# EAGLE design openplayer (EAGLE 4.16)
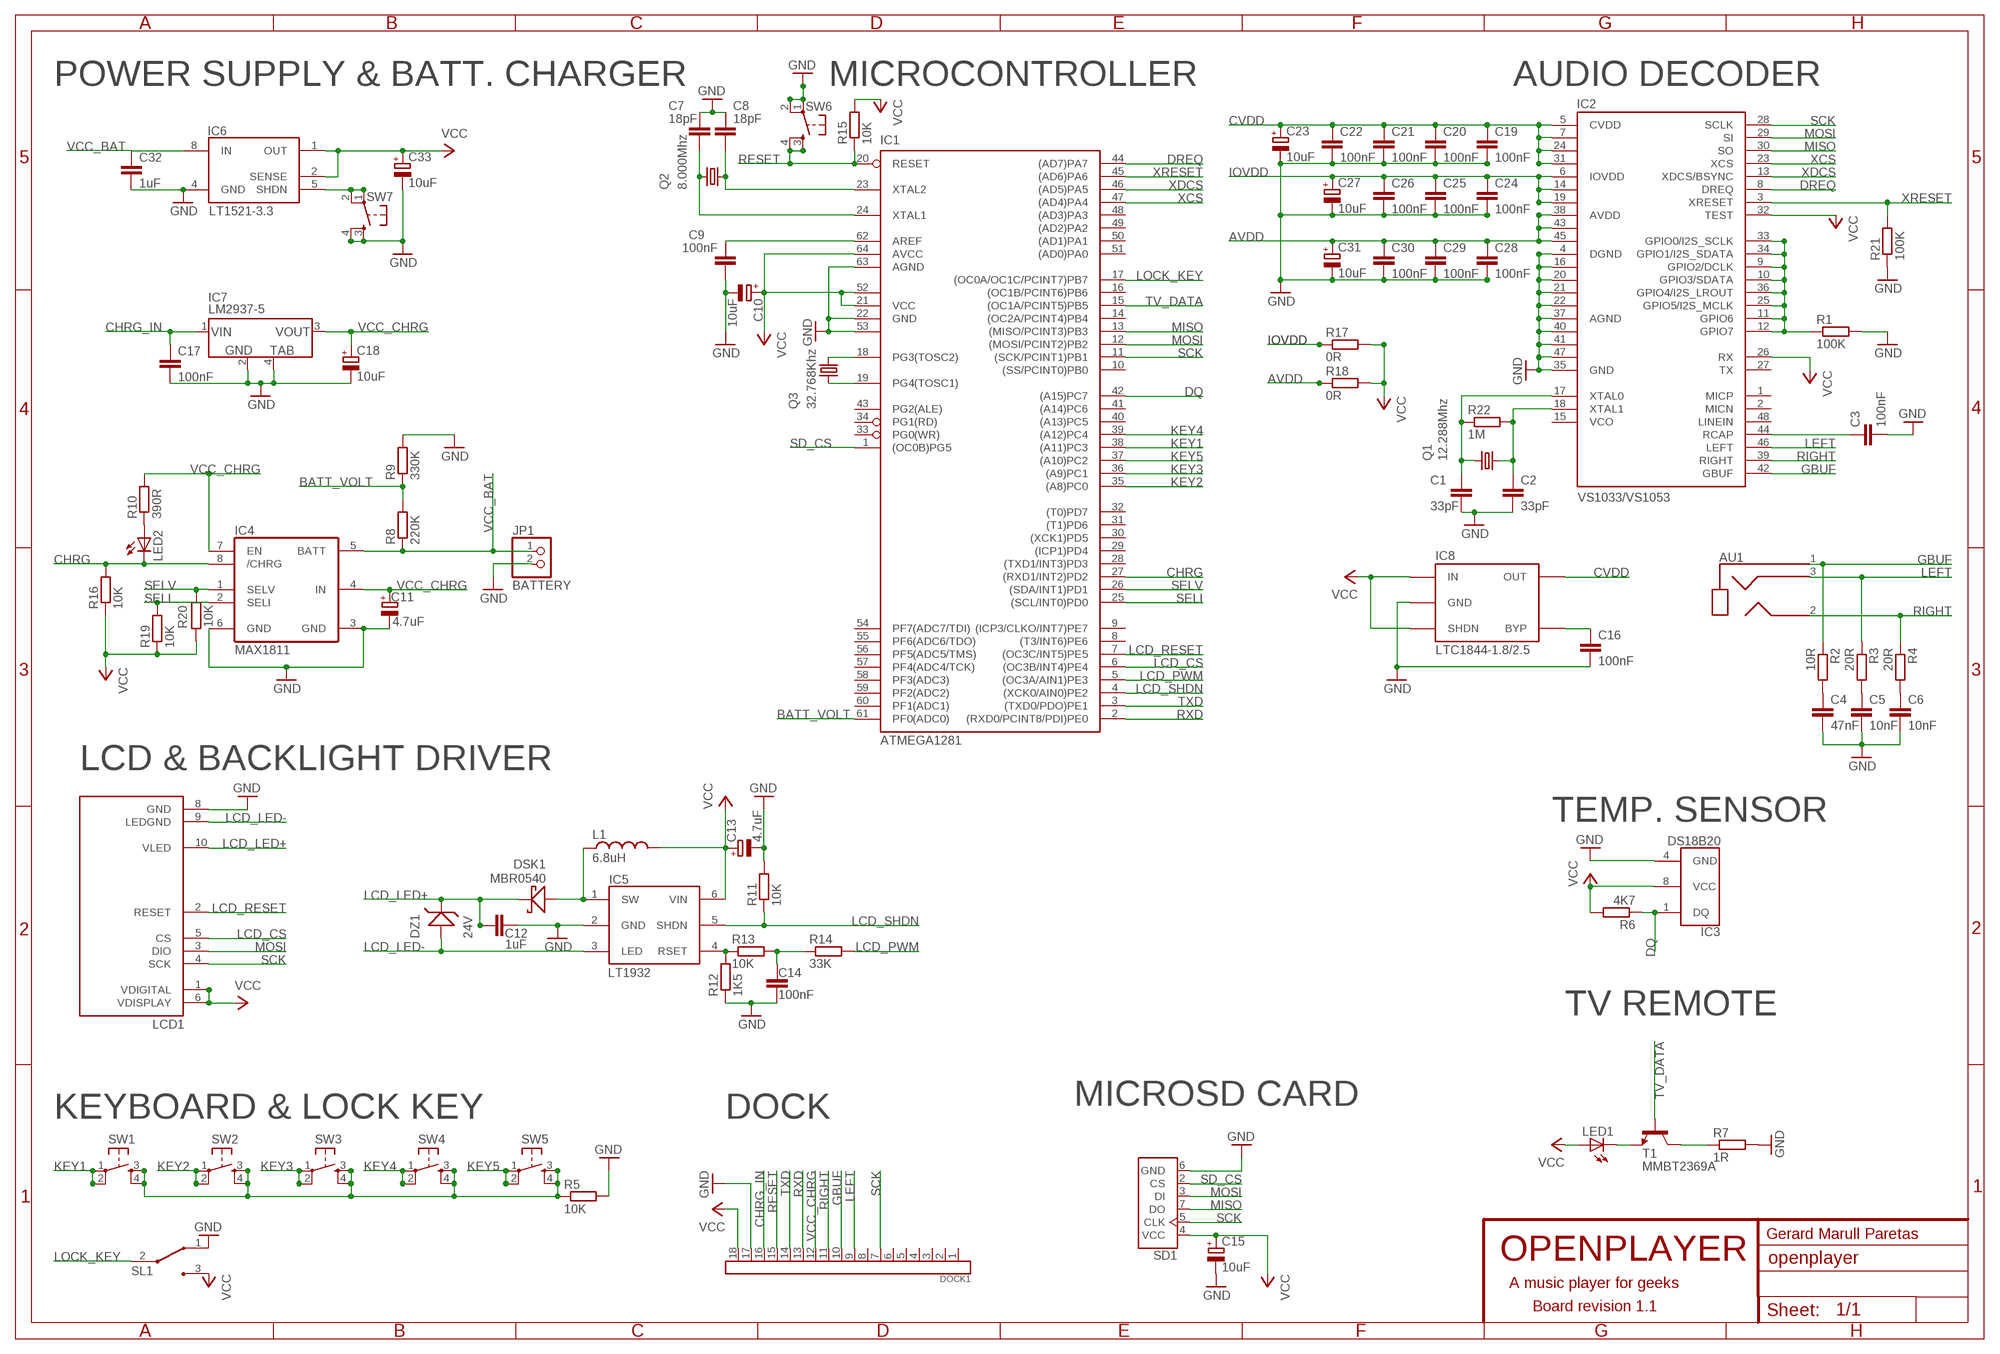
[diagram p0: schematic, sheet 1]

## Parts
AU1  AUDIOJACK_3.5MM  [AUDIOJACK3.5MM]
C1  33pF  C-EUC0805  [C0805]
C2  33pF  C-EUC0805  [C0805]
C3  100nF  C-EUC0805  [C0805]
C4  47nF  C-EUC0805  [C0805]
C5  10nF  C-EUC0805  [C0805]
C6  10nF  C-EUC0805  [C0805]
C7  18pF  C-EUC0805  [C0805]
C8  18pF  C-EUC0805  [C0805]
C9  100nF  C-EUC0805  [C0805]
C10  10uF  CPOL-EUR/2012-12R  [R/2012-12R]
C11  4.7uF  CPOL-EUA/3216-18R  [A/3216-18R]
C12  1uF  C-EUC0805  [C0805]
C13  4.7uF  CPOL-EUR/2012-12R  [R/2012-12R]
C14  100nF  C-EUC0805  [C0805]
C15  10uF  CPOL-EUR/2012-12R  [R/2012-12R]
C16  100nF  C-EUC0805  [C0805]
C17  100nF  C-EUC0805  [C0805]
C18  10uF  CPOL-EUA/3216-18W  [A/3216-18W]
C19  100nF  C-EUC0805  [C0805]
C20  100nF  C-EUC0805  [C0805]
C21  100nF  C-EUC0805  [C0805]
C22  100nF  C-EUC0805  [C0805]
C23  10uF  CPOL-EUR/2012-12R  [R/2012-12R]
C24  100nF  C-EUC0805  [C0805]
C25  100nF  C-EUC0805  [C0805]
C26  100nF  C-EUC0805  [C0805]
C27  10uF  CPOL-EUR/2012-12R  [R/2012-12R]
C28  100nF  C-EUC0805  [C0805]
C29  100nF  C-EUC0805  [C0805]
C30  100nF  C-EUC0805  [C0805]
C31  10uF  CPOL-EUR/2012-12R  [R/2012-12R]
C32  1uF  C-EUC0805  [C0805]
C33  10uF  CPOL-EUA/3216-18W  [A/3216-18W]
DOCK1  HS-ST60_18POS  [HS_ST60-18POS]
DSK1  MBR0540  SCHOTTKY-DIODE-MBR0540  [SOD-123]
DZ1  24V  ZENER_DIODE  [SOT23]
IC1  MEGA1281-A  [TQFP64]
IC2  VS1033/VS1053  VS1033  [LQFP48]
IC3  DS18B20USOP8  [USOP8]
IC4  MAX1811  [SO08]
IC5  LT1932  [S6]
IC6  LT1521-3.3  LT1521-3.3-MSOP  [USOP8]
IC7  LM2937-5  LM2937  [SOT223]
IC8  LTC1844-1.8/2.5  LTC1844  [SOT23-5]
JP1  BATTERY  PINHD-1X2  [1X02]
L1  6.8uH  INDUCTORS1008  [S1008]
LCD1  NOKIA6100_LCD  [NOKIA6100_LCD]
LED1  LED5MM  [LED5MM]
LED2  LEDCHIPLED_0603  [CHIPLED_0603]
Q1  12.288Mhz  CRYSTAL5.0X3.2MM  [CRYST5.0X3.2MM]
Q2  8.000Mhz  CRYSTAL6.0X3.6MM  [CRYST6.0X3.6MM]
Q3  32.768Khz  CRYSTAL3.2X1.5MM  [CRYST3.2X1.5MM]
R1  100K  R-EU_R0603  [R0603]
R2  10R  R-EU_R0603  [R0603]
R3  20R  R-EU_R0603  [R0603]
R4  20R  R-EU_R0603  [R0603]
R5  10K  R-EU_R0603  [R0603]
R6  4K7  R-EU_R0603  [R0603]
R7  1R  R-EU_R0603  [R0603]
R8  220K  R-EU_R0603  [R0603]
R9  330K  R-EU_R0603  [R0603]
R10  390R  R-EU_R0603  [R0603]
R11  10K  R-EU_R0603  [R0603]
R12  1K5  R-EU_R0603  [R0603]
R13  10K  R-EU_R0603  [R0603]
R14  33K  R-EU_R0603  [R0603]
R15  10K  R-EU_R0603  [R0603]
R16  10K  R-EU_R0603  [R0603]
R17  0R  R-EU_R0805  [R0805]
R18  0R  R-EU_R0805  [R0805]
R19  10K  R-EU_R0603  [R0603]
R20  10K  R-EU_R0603  [R0603]
R21  100K  R-EU_R0603  [R0603]
R22  1M  R-EU_R0603  [R0603]
SD1  SF-MICROSD  [MICROSD]
SL1  E-SWITCH_EG1270  [E-SWITCH_EG1270]
SW1  B3F-SWITCH  [B3FS-SWITCH]
SW2  B3F-SWITCH  [B3FS-SWITCH]
SW3  B3F-SWITCH  [B3FS-SWITCH]
SW4  B3F-SWITCH  [B3FS-SWITCH]
SW5  B3F-SWITCH  [B3FS-SWITCH]
SW6  ITT_SWITCH_SMALL  [ITT_SMALL_SWITCH]
SW7  ITT_SWITCH_SMALL  [ITT_SMALL_SWITCH]
T1  MMBT2369A  [SOT23]

## Nets
AVDD: C28.1 C29.1 C30.1 C31.+ IC2.38(AVDD) IC2.43(AVDD1) IC2.45(AVDD2) R18.1
BATT_VOLT: IC1.61(PF0(ADC0)) R8.2 R9.1
CHRG: IC1.27((RXD1/INT2)PD2) IC4.8(/CHRG) LED2.C R16.2
CHRG_IN: C17.1 DOCK1.16 IC7.1(VIN)
CVDD: C19.1 C20.1 C21.1 C22.1 C23.+ IC2.5(CVDD) IC2.7(CVDD1) IC2.24(CVDD2) IC2.31(CVDD3) IC8.5(OUT)
DQ: IC1.42((A15)PC7) IC3.1(DQ) R6.1
DREQ: IC1.44((AD7)PA7) IC2.8(DREQ)
GBUF: AU1.1 DOCK1.10 IC2.42(GBUF) R2.1
GND: C1.2 C2.2 C3.2 C4.2 C5.2 C6.2 C7.1 C8.1 C9.1 C10.- C11.- C12.2 C13.- C14.2 C15.- C16.2 C17.2 C18.- C19.2 C20.2 C21.2 C22.2 C23.- C24.2 C25.2 C26.2 C27.- C28.2 C29.2 C30.2 C31.- C32.2 C33.- DOCK1.17 IC1.22(GND) IC1.53(GND1) IC1.63(AGND) IC2.4(DGND) IC2.16(DGND1) IC2.20(DGND2) IC2.21(DGND3) IC2.22(DGND4) IC2.35(GND) IC2.37(AGND) IC2.40(AGND1) IC2.41(AGND2) IC2.47(AGND3) IC3.4(GND) IC4.3(GND) IC4.6(GND) IC5.2(GND) IC6.4(GND) IC7.2(GND) IC7.4 IC8.2(GND) JP1.2 LCD1.8(GND) R1.2 R5.2 R7.2 R9.2 R11.2 R12.1 R21.1 SD1.6(GND) SL1.1 SW6.1(P) SW6.2(P1) SW7.3(S) SW7.4(S1)
IOVDD: C24.1 C25.1 C26.1 C27.+ IC2.6(IOVDD) IC2.14(IOVDD1) IC2.19(IOVDD2) R17.1
KEY1: IC1.38((A11)PC3) SW1.1(P) SW1.2(P1)
KEY2: IC1.35((A8)PC0) SW2.1(P) SW2.2(P1)
KEY3: IC1.36((A9)PC1) SW3.1(P) SW3.2(P1)
KEY4: IC1.39((A12)PC4) SW4.1(P) SW4.2(P1)
KEY5: IC1.37((A10)PC2) SW5.1(P) SW5.2(P1)
LCD_CS: IC1.6((OC3B/INT4)PE4) LCD1.5(CS)
LCD_LED+: C12.1 DSK1.1 DZ1.3(AN) LCD1.10(VLED)
LCD_LED-: DZ1.1(CA) IC5.3(LED) LCD1.9(LEDGND)
LCD_PWM: IC1.5((OC3A/AIN1)PE3) R14.2
LCD_RESET: IC1.7((OC3C/INT5)PE5) LCD1.2(RESET)
LCD_SHDN: IC1.4((XCK0/AIN0)PE2) IC5.5(SHDN) R11.1
LEFT: AU1.3 DOCK1.9 IC2.46(LEFT) R3.1
LOCK_KEY: IC1.17((OC0A/OC1C/PCINT7)PB7) SL1.2
MISO: IC1.13((MISO/PCINT3)PB3) IC2.30(SO) SD1.7(DO)
MOSI: IC1.12((MOSI/PCINT2)PB2) IC2.29(SI) LCD1.3(DIO) SD1.3(DI)
N$1: C1.1 IC2.17(XTAL0) Q1.1 R22.1
N$2: C2.1 IC2.18(XTAL1) Q1.3 R22.2
N$3: C4.1 R2.2
N$4: C5.1 R3.2
N$5: C6.1 R4.2
N$6: C8.2 IC1.23(XTAL2) Q2.3
N$7: C7.2 IC1.24(XTAL1) Q2.1
N$8: C9.2 IC1.62(AREF)
N$9: IC2.9(GPIO2/DCLK) IC2.10(GPIO3/SDATA) IC2.11(GPIO6) IC2.12(GPIO7) IC2.25(GPIO5/I2S_MCLK) IC2.33(GPIO0/I2S_SCLK) IC2.34(GPIO1/I2S_SDATA) IC2.36(GPIO4/I2S_LROUT) R1.1
N$10: IC1.18(PG3(TOSC2)) Q3.2
N$11: IC1.19(PG4(TOSC1)) Q3.1
N$12: C3.1 IC2.44(RCAP)
N$13: R5.1 SW1.3(S) SW1.4(S1) SW2.3(S) SW2.4(S1) SW3.3(S) SW3.4(S1) SW4.3(S) SW4.4(S1) SW5.3(S) SW5.4(S1)
N$14: LED1.K(C) T1.3(E)
N$15: R7.1 T1.2(C)
N$18: LED2.A R10.1
N$19: DSK1.2 IC5.1(SW) L1.P$1
N$20: C16.1 IC8.4(BYP)
N$21: IC5.4(RSET) R12.2 R13.1
N$23: IC6.5(SHDN) SW7.1(P) SW7.2(P1)
N$24: C14.1 R13.2 R14.1
RESET: DOCK1.15 IC1.20(RESET) R15.1 SW6.3(S) SW6.4(S1)
RIGHT: AU1.2 DOCK1.11 IC2.39(RIGHT) R4.1
RXD: DOCK1.13 IC1.2((RXD0/PCINT8/PDI)PE0)
SCK: DOCK1.7 IC1.11((SCK/PCINT1)PB1) IC2.28(SCLK) LCD1.4(SCK) SD1.5(CLK)
SD_CS: IC1.1((OC0B)PG5) SD1.2(CS)
SELI: IC1.25((SCL/INT0)PD0) IC4.2(SELI) R19.2
SELV: IC1.26((SDA/INT1)PD1) IC4.1(SELV) R20.2
TV_DATA: IC1.15((OC1A/PCINT5)PB5) T1.1(B)
TXD: DOCK1.14 IC1.3((TXD0/PDO)PE1)
VCC: C10.+ C13.+ C15.+ C33.+ DOCK1.18 IC1.21(VCC) IC1.52(VCC1) IC1.64(AVCC) IC2.26(RX) IC2.32(TEST) IC3.8(VCC) IC5.6(VIN) IC6.1(OUT) IC6.2(SENSE) IC8.1(IN) IC8.3(SHDN) L1.P$2 LCD1.1(VDIGITAL) LCD1.6(VDISPLAY) LED1.A R6.2 R15.2 R16.1 R17.2 R18.2 R19.1 R20.1 SD1.4(VCC) SL1.3
VCC_BAT: C32.1 IC4.5(BATT) IC6.8(IN) JP1.1 R8.1
VCC_CHRG: C11.+ C18.+ DOCK1.12 IC4.4(IN) IC4.7(EN) IC7.3(VOUT) R10.2
XCS: IC1.47((AD4)PA4) IC2.23(XCS)
XDCS: IC1.46((AD5)PA5) IC2.13(XDCS/BSYNC)
XRESET: IC1.45((AD6)PA6) IC2.3(XRESET) R21.2
Unconnected: DOCK1.1 DOCK1.2 DOCK1.3 DOCK1.4 DOCK1.5 DOCK1.6 DOCK1.8 IC1.8((T3/INT6)PE6) IC1.9((ICP3/CLKO/INT7)PE7) IC1.10((SS/PCINT0)PB0) IC1.14((OC2A/PCINT4)PB4) IC1.16((OC1B/PCINT6)PB6) IC1.28((TXD1/INT3)PD3) IC1.29((ICP1)PD4) IC1.30((XCK1)PD5) IC1.31((T1)PD6) IC1.32((T0)PD7) IC1.33(PG0(WR)) IC1.34(PG1(RD)) IC1.40((A13)PC5) IC1.41((A14)PC6) IC1.43(PG2(ALE)) IC1.48((AD3)PA3) IC1.49((AD2)PA2) IC1.50((AD1)PA1) IC1.51((AD0)PA0) IC1.54(PF7(ADC7/TDI)) IC1.55(PF6(ADC6/TDO)) IC1.56(PF5(ADC5/TMS)) IC1.57(PF4(ADC4/TCK)) IC1.58(PF3(ADC3)) IC1.59(PF2(ADC2)) IC1.60(PF1(ADC1)) IC2.1(MICP) IC2.2(MICN) IC2.15(VCO) IC2.27(TX) IC2.48(LINEIN)

## Notes on the sheet
- POWER SUPPLY & BATT. CHARGER | MICROCONTROLLER | AUDIO DECODER
- LCD & BACKLIGHT DRIVER
- TEMP. SENSOR
- TV REMOTE
- MICROSD CARD
- KEYBOARD & LOCK KEY | DOCK
- Gerard Marull Paretas
- OPENPLAYER
- A music player for geeks
- Board revision 1.1

## Library data of the parts
AU1 = openplayer:AUDIOJACK_3.5MM
C1-C9 C12 C14 C16 C17 C19-C22 C24-C26 C28-C30 C32 = rcl:C-EU: CAPACITOR, European symbol
C10 C11 C13 C15 C18 C23 C27 C31 C33 = rcl:CPOL-EU: POLARIZED CAPACITOR, European symbol
DOCK1 = openplayer:HS-ST60_18POS
DSK1 = openplayer:SCHOTTKY-DIODE-MBR0540
DZ1 = openplayer:ZENER_DIODE
IC1 = openplayer:MEGA1281: MICROCONTROLLER 128 Kbytes FLASH 4 Kbytes SRAM 4 Kbytes EEPROM DUAL USART 8-channel 10 bit ADC Source: avr.lbr
IC2 = openplayer:VS1033
IC3 = openplayer:DS18B20
IC4 = openplayer:MAX1811
IC5 = openplayer:LT1932
IC6 = openplayer:LT1521-3.3-MSOP
IC7 = openplayer:LM2937
IC8 = openplayer:LTC1844
JP1 = pinhead:PINHD-1X2: PIN HEADER
L1 = openplayer:INDUCTOR
LCD1 = openplayer:NOKIA6100_LCD
LED1 LED2 = led:LED: LED OSRAM: - CHIPLED LG R971, LG N971, LY N971, LG Q971, LY Q971, LO R971, LY R971 LH N974, LH R974 LS Q976, LO Q976, LY Q976 LO Q996 - Hyper CHIPLED LW Q18S LB Q993, LB Q99A, LB R99A - SideLED LS A670, LO A670, LY A670, LG A670, LP A670 LB A673, LV A673, LT A673, LW A673 LH A674 LY A675 LS A676, LA A676, LO A676, LY A676, LW A676 LS A679, LY A679, LG A679 - Hyper Micro SIDELED® LS Y876, LA Y876, LO Y876, LY Y876 LT Y87S - SmartLED LW L88C, LW L88S LB L89C, LB L89S, LG L890 LS L89K, LO L89K, LY L89K LS L896, LA L896, LO L896, LY L896 - TOPLED LS T670, LO T670, LY T670, LG T670, LP T670 LSG T670, LSP T670, LSY T670, LOP T670, LYG T670 LG T671, LOG T671, LSG T671 LB T673, LV T673, LT T673, LW T673 LH T674 LS T676, LA T676, LO T676, LY T676, LB T676, LH T676, LSB T676, LW T676 LB T67C, LV T67C, LT T67C, LS T67K, LO T67K, LY T67K, LW E67C LS E67B, LA E67B, LO E67B, LY E67B, LB E67C, LV E67C, LT E67C LW T67C LS T679, LY T679, LG T679 LS T770, LO T770, LY T770, LG T770, LP T770 LB T773, LV T773, LT T773, LW T773 LH T774 LS E675, LA E675, LY E675, LS T675 LS T776, LA T776, LO T776, LY T776, LB T776 LHGB T686 LT T68C, LB T68C - Hyper Mini TOPLED® LB M676 - Mini TOPLED Santana® LG M470 LS M47K, LO M47K, LY M47K Source: http://www.osram.convergy.de/
Q1-Q3 = openplayer:CRYSTAL
R1-R22 = rcl:R-EU_: RESISTOR, European symbol
SD1 = openplayer:SF-MICROSD
SL1 = openplayer:E-SWITCH_EG1270
SW1-SW5 = openplayer:B3F-SWITCH
SW6 SW7 = openplayer:ITT_SWITCH_SMALL
T1 = openplayer:MMBT2369A

## Board
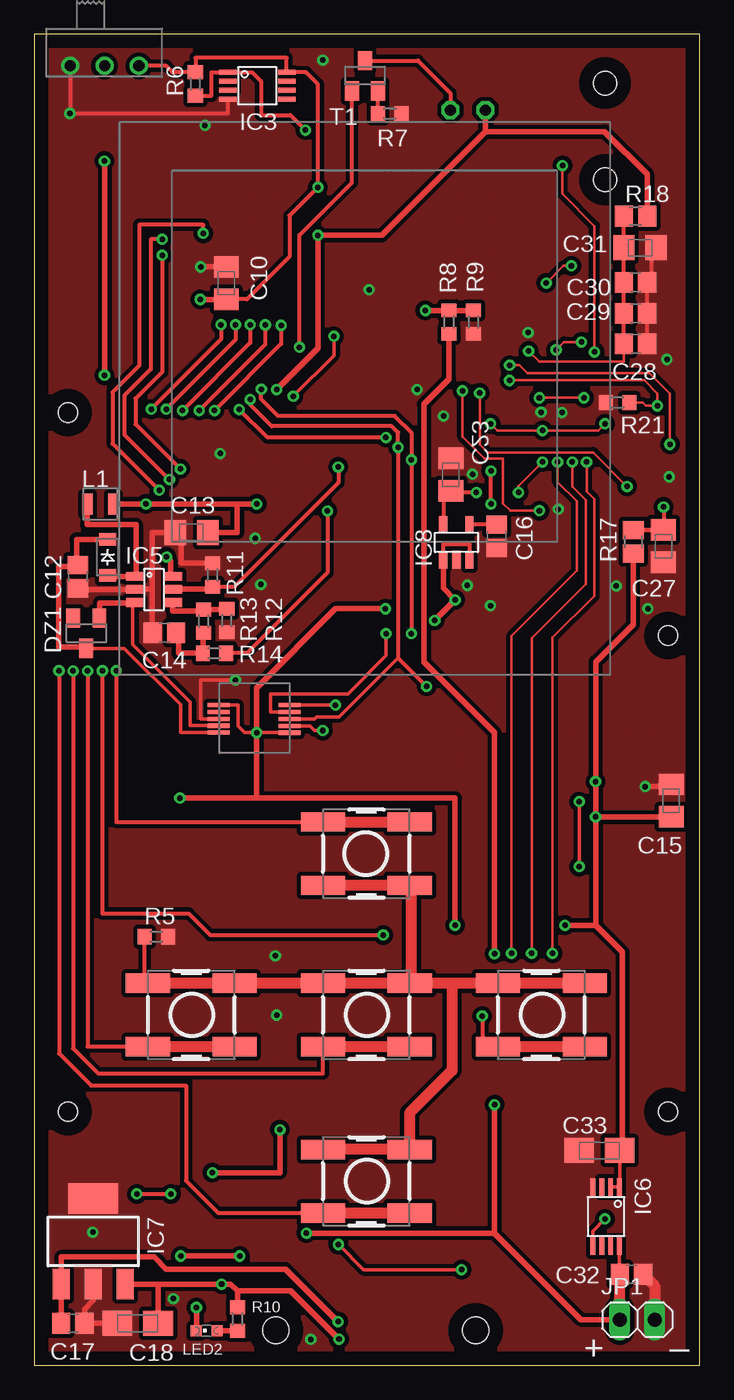
[diagram p1: board, top side]
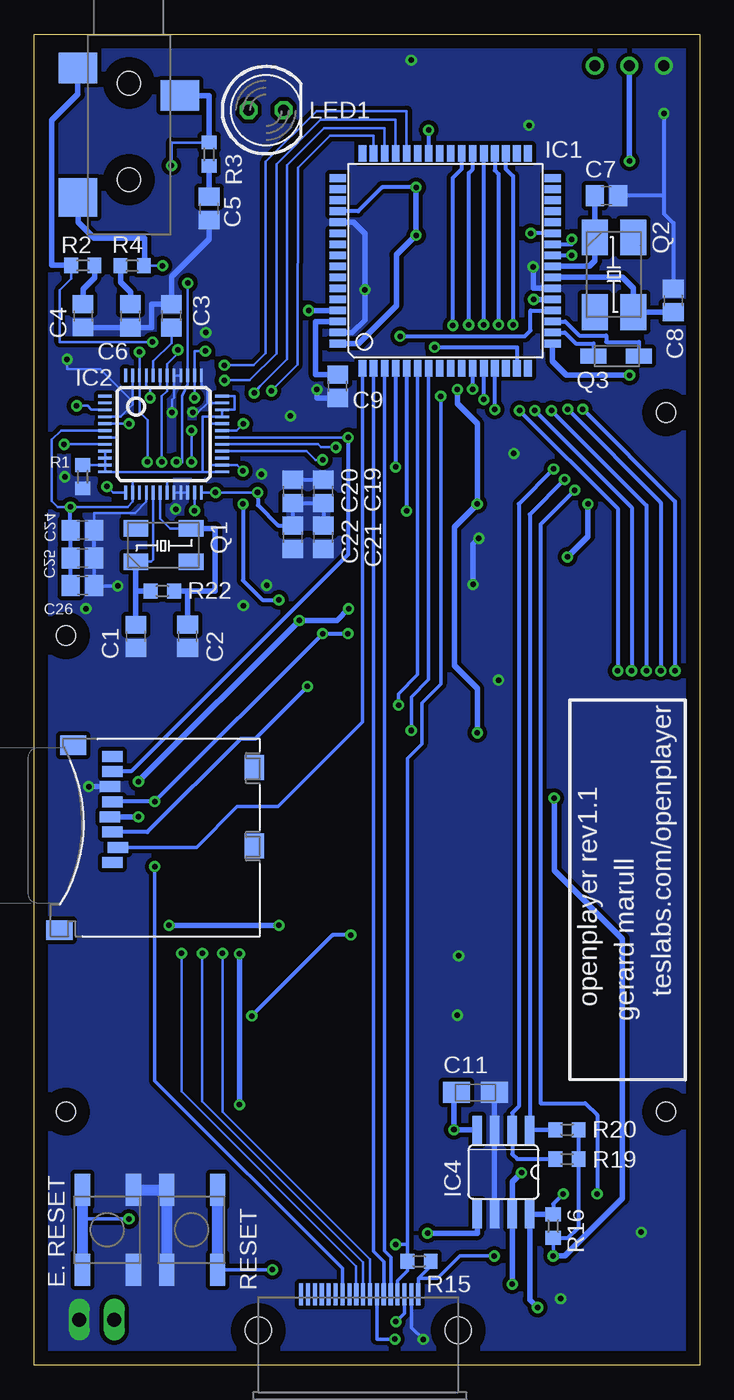
[diagram p2: board, bottom side, seen from below]

Size 48.26 x 96.52 mm. Coordinates in mm from the lower left corner, seen from the top.
Outline: 0,0 48.26,0 48.26,96.52 0,96.52 0,0
Copper layers (1*16): Top 0.035mm / dielectric 1.5mm / Bottom 0.035mm
Design rules "default": minimum track width 7mil, minimum drill 15mil, track to track 7mil, track to pad 7mil, pad to pad 7mil, via to via 7mil, smd to smd 7mil, copper to edge 40mil, drill to drill 8mil, minimum pad ring 10mil, minimum via ring 8mil, stop-mask expansion 4mil, vias tented up to drill 0mil, thermal gap 10mil
Holes 1.4 mm at 45.97,18.39 2.43,18.39 2.43,69.09 45.97,52.92

### Footprints (pad centres in the part's own frame; a part is rotated, then mirrored left to right if it is on the bottom)
AUDIOJACK3.5MM = smd 2.2 x 2.8: 1 4.74,3.87; 3 2.74,-3.53 | smd 2.8 x 2.8: 2 -4.66,3.87 | hole 1.7: 3.64,0.17; -3.36,0.17
C0805 = smd 1.3 x 1.5: 1 -0.85,0; 2 0.85,0
R/2012-12R = smd 1.55 x 1.8: + 1.175,0; - -1.175,0
A/3216-18R = smd 1.95 x 1.5: + 1.375,0; - -1.375,0
A/3216-18W = smd 2.15 x 1.8: + 1.475,0; - -1.475,0
HS_ST60-18POS = smd 0.3 x 1.6: 1 -4.1,3.9; 2 -3.6,3.9; 3 -3.1,3.9; 4 -2.6,3.9; 5 -2.1,3.9; 6 -1.6,3.9; 7 -1.1,3.9; 8 -0.6,3.9; 9 -0.1,3.9; 10 0.4,3.9; 11 0.9,3.9; 12 1.4,3.9; 13 1.9,3.9; 14 2.4,3.9; 15 2.9,3.9; 16 3.4,3.9; 17 3.9,3.9; 18 4.4,3.9 | hole 1.9: -7.2,1.3; 7.3,1.3
SOD-123 = smd 0.91 x 1.22: 1 -1.34,-0.03; 2 1.26,-0.02
SOT23 = smd 1 x 1.4: 1 -0.95,-1.1; 2 0.95,-1.1; 3 0,1.1
TQFP64 = smd 1.194 x 0.559: 1 -7.8,6; 2 -7.8,5.2; 3 -7.8,4.4; 4 -7.8,3.6; 5 -7.8,2.8; 6 -7.8,2; 7 -7.8,1.2; 8 -7.8,0.4; 9 -7.8,-0.4; 10 -7.8,-1.2; 11 -7.8,-2; 12 -7.8,-2.8; 13 -7.8,-3.6; 14 -7.8,-4.4; 15 -7.8,-5.2; 16 -7.8,-6; 33 7.8,-6; 34 7.8,-5.2; 35 7.8,-4.4; 36 7.8,-3.6; 37 7.8,-2.8; 38 7.8,-2; 39 7.8,-1.2; 40 7.8,-0.4; 41 7.8,0.4; 42 7.8,1.2; 43 7.8,2; 44 7.8,2.8; 45 7.8,3.6; 46 7.8,4.4; 47 7.8,5.2; 48 7.8,6 | smd 0.559 x 1.194: 17 -6,-7.8; 18 -5.2,-7.8; 19 -4.4,-7.8; 20 -3.6,-7.8; 21 -2.8,-7.8; 22 -2,-7.8; 23 -1.2,-7.8; 24 -0.4,-7.8; 25 0.4,-7.8; 26 1.2,-7.8; 27 2,-7.8; 28 2.8,-7.8; 29 3.6,-7.8; 30 4.4,-7.8; 31 5.2,-7.8; 32 6,-7.8; 49 6,7.8; 50 5.2,7.8; 51 4.4,7.8; 52 3.6,7.8; 53 2.8,7.8; 54 2,7.8; 55 1.2,7.8; 56 0.4,7.8; 57 -0.4,7.8; 58 -1.2,7.8; 59 -2,7.8; 60 -2.8,7.8; 61 -3.6,7.8; 62 -4.4,7.8; 63 -5.2,7.8; 64 -6,7.8
LQFP48 = smd 0.2 x 1: 1 -2.75,-4.25; 2 -2.25,-4.25; 3 -1.75,-4.25; 4 -1.25,-4.25; 5 -0.75,-4.25; 6 -0.25,-4.25; 7 0.25,-4.25; 8 0.75,-4.25; 9 1.25,-4.25; 10 1.75,-4.25; 11 2.25,-4.25; 12 2.75,-4.25; 25 2.75,4.25; 26 2.25,4.25; 27 1.75,4.25; 28 1.25,4.25; 29 0.75,4.25; 30 0.25,4.25; 31 -0.25,4.25; 32 -0.75,4.25; 33 -1.25,4.25; 34 -1.75,4.25; 35 -2.25,4.25; 36 -2.75,4.25 | smd 1 x 0.2: 13 4.25,-2.75; 14 4.25,-2.25; 15 4.25,-1.75; 16 4.25,-1.25; 17 4.25,-0.75; 18 4.25,-0.25; 19 4.25,0.25; 20 4.25,0.75; 21 4.25,1.25; 22 4.25,1.75; 23 4.25,2.25; 24 4.25,2.75; 37 -4.25,2.75; 38 -4.25,2.25; 39 -4.25,1.75; 40 -4.25,1.25; 41 -4.25,0.75; 42 -4.25,0.25; 43 -4.25,-0.25; 44 -4.25,-0.75; 45 -4.25,-1.25; 46 -4.25,-1.75; 47 -4.25,-2.25; 48 -4.25,-2.75
USOP8 = smd 0.36 x 1.27: 1 -0.42,-0.4; 2 0.23,-0.4; 3 0.88,-0.4; 4 1.53,-0.4; 5 1.53,3.87; 6 0.88,3.87; 7 0.23,3.87; 8 -0.42,3.87
SO08 = smd 0.66 x 2.032: 1 -1.905,-3.073; 2 -0.635,-3.073; 3 0.635,-3.073; 4 1.905,-3.073; 5 1.905,3.073; 6 0.635,3.073; 7 -0.635,3.073; 8 -1.905,3.073
S6 = smd 0.62 x 1.22: 1 -0.98,-1.34; 2 -0.03,-1.34; 3 0.92,-1.34; 4 0.92,1.49; 5 -0.03,1.49; 6 -0.98,1.49
SOT223 = smd 1.219 x 2.235: 1 -2.311,-3.099; 2 0,-3.099; 3 2.311,-3.099 | smd 3.6 x 2.2: 4 0,3.099
SOT23-5 = smd 0.6 x 1.2: 1 -0.95,-1.306; 2 0,-1.306; 3 0.95,-1.306; 4 0.95,1.306; 5 -0.95,1.306
1X02 = drill 1.016 long: 1 -1.27,0; 2 1.27,0
S1008 = smd 0.76 x 1.52: P$1 0,0; P$2 1.9,0
NOKIA6100_LCD = smd 1.6 x 0.3: 1 24.255,44.311; 2 24.255,43.811; 3 24.255,43.311; 4 24.255,42.811; 5 24.255,42.311; 6 29.389,42.303; 7 29.389,42.803; 8 29.389,43.303; 9 29.389,43.803; 10 29.389,44.303
LED5MM = drill 0.813 octagon: A -1.27,0; K 1.27,0
CHIPLED_0603 = smd 0.8 x 0.8: A 0,-0.75; C 0,0.75
CRYST5.0X3.2MM = smd 1.8 x 1.2: 1 -2.3,-1.1; 2 1.7,-1.1; 3 1.7,1.3; 4 -2.3,1.3
CRYST6.0X3.6MM = smd 2.58 x 1.9: 1 -3.4,-1.83; 2 2.03,-1.84; 3 2.03,0.96; 4 -3.4,0.96
CRYST3.2X1.5MM = smd 1.9 x 1.1: 1 -1.6,0.05; 2 1.7,0.05
R0603 = smd 1 x 1.1: 1 -0.85,0; 2 0.85,0
R0805 = smd 1.3 x 1.5: 1 -0.85,0; 2 0.85,0
MICROSD = smd 0.8 x 1.5: 1 -1.94,2.7; 2 -0.84,2.3; 3 0.26,2.7; 4 1.36,2.9; 5 2.46,2.7; 6 3.56,2.9; 7 4.66,2.7; 8 5.76,2.7 | smd 1.4 x 1.9: NC -6.85,6.55; NC3 6.55,5.55 | smd 1.8 x 1.4: NC1 -0.75,-7.6; NC2 4.95,-7.6
E-SWITCH_EG1270 = drill 0.8 round: 1 -1.5,2.5; 2 -1.5,0; 3 -1.5,-2.5
B3FS-SWITCH = smd 3.2 x 1.4: 1 3.1,-2.3; 2 -3.2,-2.3; 3 3.1,2.3; 4 -3.2,2.3
ITT_SMALL_SWITCH = smd 2.3 x 1.1: 1 -2.9,1.8; 2 2.9,1.8; 3 -2.9,-1.9; 4 2.9,-1.9

### Placement (x,y rotation side)
AU1  41.24,89.34 90 bottom
C1  40.9,52.85 270 bottom
C2  37.15,52.87 270 bottom
C3  38.32,76.11 90 bottom
C4  44.73,76.12 270 bottom
C5  35.58,83.89 270 bottom
C6  41.29,76.11 270 bottom
C7  6.74,84.82 180 bottom
C8  1.9,77.23 270 bottom
C9  26.26,70.99 90 bottom
C10  13.93,78.48 270 top
C11  16.25,19.78 180 bottom
C12  3.16,57.19 270 top
C13  11.39,60.39 0 top
C14  9.42,53.11 180 top
C15  46.2,40.94 270 top
C16  33.54,60.12 270 top
C17  2.79,3.03 0 top
C18  7.5,3.03 0 top
C19  27.3,63.39 90 bottom
C20  29.51,63.39 90 bottom
C21  27.3,60.05 270 bottom
C22  29.51,60.05 270 bottom
C23  30.22,64.59 270 top
C24  44.77,60.56 0 bottom
C25  44.77,58.54 0 bottom
C26  44.77,56.54 0 bottom
C27  45.64,59.4 90 top
C28  43.62,74.08 0 top
C29  43.62,76.28 0 top
C30  43.62,78.54 0 top
C31  43.94,81.05 180 top
C32  43.32,6.58 0 top
C33  40.98,15.56 0 top
DOCK1  24.81,1.22 0 bottom
DSK1  5.33,58.55 270 top
DZ1  3.76,53.08 180 top
IC1  18.45,80.1 90 bottom
IC2  38.89,67.54 270 bottom
IC3  14.44,93.36 270 top
IC4  14.23,14 180 bottom
IC5  8.6,56.23 270 top
IC6  42.04,12.51 180 top
IC7  4.26,8.97 0 top
IC8  30.62,59.67 0 top
JP1  43.74,3.29 0 top
L1  3.84,62.46 0 top
LCD1  42.76,90.18 180 top
LED1  31.45,91.03 0 bottom
LED2  12.49,2.49 90 top
Q1  38.6,59.38 0 bottom
Q2  5.76,78.41 270 bottom
Q3  6,73.23 180 bottom
R1  44.76,64.44 270 bottom
R2  44.75,79.77 0 bottom
R3  35.58,87.83 270 bottom
R4  41.17,79.74 180 bottom
R5  8.85,31.08 0 top
R6  11.68,92.93 90 top
R7  25.78,90.77 0 top
R8  30.08,75.65 90 top
R9  31.86,75.65 270 top
R10  14.73,3.34 90 top
R11  12.93,57.3 90 top
R12  13.95,54 90 top
R13  12.27,53.96 270 top
R14  13.06,51.63 0 top
R15  20.35,7.53 0 bottom
R16  10.62,10.08 90 bottom
R17  43.45,59.72 270 top
R18  43.61,83.34 0 top
R19  9.62,14.94 180 bottom
R20  9.62,17.07 180 bottom
R21  42.32,69.81 0 top
R22  38.98,56.15 0 bottom
SD1  39.89,38.4 90 bottom
SL1  5.08,95.74 90 top
SW1  36.83,25.4 0 top
SW2  24.13,13.33 0 top
SW3  24.13,25.4 0 top
SW4  24.03,37.09 180 top
SW5  11.43,25.4 0 top
SW6  36.86,9.81 90 bottom
SW7  42.98,9.81 90 bottom
T1  23.99,93.52 0 top

### Tracks (layer width: path | path; a pad name or v marks a point on that pad's centre or on a via)
AVDD  (via drill 0.4)
  Top 0.18: 42.77,74.04 42.77,72.77 36.64,72.77 v35.86,73.55 | v36.64,70.16 v39.87,70.16
  Top 0.305: 42.77,78.52 C30.1 C29.1 | 42.77,78.52 C31.+ | 42.77,78.52 42.76,78.52 | C29.1 | 42.77,74.04 C28.1 | 42.77,74.04 C29.1 | 42.77,74.04 42.78,74.04 | C31.+ R18.1 | C31.+ 42.74,81.05
  Bottom 0.18: IC2.45 40.14,70.86 39.87,70.86 | 39.87,70.86 39.14,70.86 IC2.43 | v35.86,73.55 36.64,73.55 IC2.38 v36.64,70.16 | v39.87,70.16 39.87,70.86
BATT_VOLT  (via drill 0.4)
  Top 0.406: R9.1 R8.2 v28.37,76.5
  Bottom 0.406: IC1.61 v28.37,76.5
CHRG  (via drill 0.4)
  Top 0.305: v7.43,12.41 v9.89,12.41 | v12.25,82.1 12.25,82.72 7.61,82.72 7.61,72.5 5.67,70.56 5.67,66.84 v9.05,63.46
  Top 0.406: LED2.C 11.74,2.52 11.75,2.53 v11.75,4.17
  Bottom 0.305: R16.2 10.62,11.68 v9.89,12.41 | v7.43,12.41 7.43,18.14 8.29,19 11.54,19 11.54,60.97 v9.05,63.46 | IC1.27 v12.25,82.1
  Bottom 0.406: R16.2 | R16.2 IC4.8 12.32,4.74 v11.75,4.17
CHRG_IN  (via drill 0.4)
  Top 0.305: 1.95,5.84 1.94,5.83
  Top 0.406: 1.95,5.84 IC7.1 | 1.94,5.83 C17.1 | 1.95,5.84 1.95,7.85 8.67,7.85 9.57,6.95 18.22,6.95 v22.03,3.14
  Bottom 0.254: DOCK1.16 | DOCK1.16 21.41,5.2 | DOCK1.16 21.41,3.76 v22.03,3.14
CVDD  (via drill 0.4)
  Top 0.18: v35.12,63.29 35.12,63.77 v36.86,65.51 | v33.1,68.29 33.6,67.79 v36.86,67.79 40.9,67.79 v41.4,68.29
  Top 0.305: 30.23,63.25 30.23,63.24 C23.+ | IC8.5 29.67,62.86 C23.+ | C23.+ 30.23,63.29 v32.07,63.29
  Bottom 0.18: IC2.7 42.21,67.29 42.21,68.29 | 42.21,68.29 IC2.5 | v41.4,68.29 42.21,68.29 | v36.86,65.51 v36.86,67.79 | v32.07,63.29 v35.12,63.29 IC2.24 | v33.1,68.29 33.6,67.79 IC2.31
  Bottom 0.305: C20.1 29.53,62.54 | C20.1 C19.1 C21.1 27.3,60.88 | C20.1 29.51,62.57 | C20.1 C22.1 30.57,60.9 32.05,62.38 v32.07,63.29
  pour Bottom (no thermals, hatched): 26.92,62.74 26.92,60.64 29.84,60.64 29.84,62.86 26.92,62.86
DQ  (via drill 0.4)
  Top 0.305: v19.66,89.58 18.57,90.67 16.44,90.67 16.44,93.12 15.78,93.78 IC3.1 12.84,93.78 12.84,92.08 R6.1
  Bottom 0.305: IC1.42 v19.66,89.58
DREQ  (via drill 0.4)
  Top 0.18: v46.11,66.79 46.11,70.45 44.6,71.96 35.77,71.96 35.2,72.53 v34.48,72.53
  Bottom 0.18: IC1.44 21.25,90.96 27.8,90.96 31.48,87.28 31.48,73.4 32.35,72.53 v34.48,72.53 | v46.11,66.79 IC2.8
GBUF  (via drill 0.4)
  Top 0.18: v39.69,74.21 38.42,74.21 v37.85,73.64 | v39.03,65.51 39.03,63.71 40,62.74 40,56.65 36.08,52.73 v36.08,29.87
  Bottom 0.18: v37.85,73.64 37.85,73.41 38.64,72.62 IC2.42 | IC2.42 | v36.08,29.87 36.08,19.14 24.41,7.47 DOCK1.10 | R2.1 45.6,78.79 46.42,77.97 46.42,74.21 v39.69,74.21 v39.68,74.21 | v39.03,65.5 v39.03,65.51 39.03,70.27 38.64,70.66 IC2.42
  Bottom 0.406: AU1.1 45.11,92.18 46.99,90.3 46.99,79.78 45.66,79.78 45.66,79.77 | 45.66,79.77 45.66,79.76 | R2.1 45.66,79.77
GND  (via drill 0.4)
  Top 0.254: 8.54,53.18 8.57,53.15 C14.2 | R11.2 | 12.1,46.88 LCD1.8 12.04,46.88 12.04,49.69 v14.58,49.69 v14.58,49.68
  Top 0.305: SL1.1 v2.58,90.79 14.04,90.79 IC3.4 | C29.2 44.47,76.24 | C29.2 C30.2 44.81,78.88 44.81,81.06 C31.- | 44.47,74.05 C28.2 C29.2
  Top 0.406: 9.85,60.39 8.54,60.39 8.54,56.38 | 8.54,56.38 8.54,56.28 7.34,56.28 7.34,56.26 IC5.2 3.05,56.26 3.05,56.34 | 9.85,60.39 C13.- | C14.2 8.54,53.11 8.54,53.18 8.54,56.38 | 3.05,56.34 3.05,56.39 | 3.05,56.34 C12.2 | C10.- v12.07,79.66 | 9.85,60.39 10.63,60.39 10.63,58.16 R11.2 | v44.32,41.96 46.2,41.96 C15.- | C18.- C17.2 | C17.2 | C17.2 | C17.2 3.64,4.06 4.26,4.68 IC7.2 4.26,5.8 4.27,5.79
  Top 0.8: C32.2 45.01,5.74 JP1.2
  Bottom 0.18: IC2.35 35.7,69.79 | 35.7,69.79 35.7,70.69 36.14,71.13 IC2.37 | IC2.22 IC2.21 IC2.20 | IC2.16 40.14,62.65 40.97,61.82 43.92,61.82 C24.2 | 41.14,69.67 IC2.47 | 41.14,69.67 42.02,68.79 IC2.4 | v38.28,69.1 38.28,69.24 38.29,69.25 38.28,69.26 38.28,70.04 38.14,70.18 IC2.41 IC2.40 | 41.14,69.67 41.14,69.89 43.5,72.25 45.89,72.25 v45.89,72.95 45.89,72.97 | 35.7,69.79 36.37,69.12 v36.77,69.12
  Bottom 0.254: v20.05,1.86 20.91,2.72 DOCK1.17 | C26.2 C25.2 | v42.22,56.51 43.92,56.51
  Bottom 0.3: DOCK1.17
  Bottom 0.305: C8.1 1.9,82.84 2.58,83.52 2.58,84.82 | v2.58,90.79 2.58,84.82 | C7.1 | C7.1 | 2.58,84.82 C7.1 | C20.2 C19.2 | C25.2 C24.2 | C26.2 43.92,56.51 43.92,56.46
  Bottom 0.406: C4.2 41.23,75.27 41.24,75.26 C6.2 41.18,75.26 41.17,75.27 39.74,75.27 39.74,76.96 C3.2 38.32,78.94 35.58,81.68 35.58,83.09 | 35.58,83.09 C5.2 | 35.58,83.09 35.6,83.11 | IC4.3 | IC4.6 IC4.3 | C11.- IC4.3 | IC1.22 | IC1.22 | IC1.22 | IC1.22 12.07,78.1 v12.07,79.66 | C9.1 27.76,70.15 v27.76,70.77 | IC1.63 25.2,74.89 24.28,75.81 v24.28,78 24.28,82.07 25.1,82.89 26.19,82.89 26.2,82.9 IC1.53 | IC1.63 | v16.02,59.97 16.43,59.56 v16.43,56.63 | SD1.6 v44.32,41.96
  Bottom 0.8: 38.66,6.87 SW6.1 SW6.2 SW7.4 | SW7.4 41.12,12.71 | 41.08,12.66 | SW7.4 41.08,12.66 | 41.08,12.66
  other vias: 13.48,66.13 17.58,25.38 12.38,89.93 38.01,62.08 20.92,94.66 31.41,56.56 46.06,64.43 35.82,74.9 17.48,29.69 4.23,9.63 10.08,4.81 33.1,55.09 44.52,54.87 31.79,64.62 29.68,68.84
  pour Bottom (isolate 0.305, no thermals): -0.67,97.36 -0.67,-1.04 49.2,-1.04 49.2,97.36
  pour Top (isolate 0.305, no thermals, hatched): -1.42,98.14 -1.42,-2.15 50.35,-2.15 50.35,98.14
IOVDD  (via drill 0.4)
  Top 0.305: C27.+ C24.1 R17.1 C27.+ v45.65,62.25
  Bottom 0.18: IC2.6 46.33,67.79 46.99,67.13 46.99,64.61 | 46.99,64.61 46.99,64.57 | 38.64,63.27 IC2.19 38.64,64.13 41.14,64.13 IC2.14 41.14,62.62 41.51,62.25 v45.65,62.25 46.56,62.25 46.99,62.68 46.99,64.61
  Bottom 0.305: C25.1 45.62,58.46 | C25.1 C24.1 C27.+ v45.65,62.25 | 45.62,56.48 C26.1 C25.1
KEY1  (via drill 0.4)
  Top 0.305: v25.31,31.2 12.76,31.2 11.2,32.76 4.93,32.76 v4.93,50.36 | v11.96,69.24 16.75,74.03 v16.75,75.45 | 33.51,23.11 32.49,23.11 v32.49,25.32
  Top 0.8: 33.51,23.1 SW1.2 | 33.51,23.1 SW1.1 | 33.51,23.11 33.51,23.1
  Bottom 0.305: v4.93,50.36 4.93,62.21 v11.96,69.24 | IC1.38 16.45,87.87 16.45,86.76 16.75,86.46 v16.75,75.45 | v32.49,25.32 v32.49,25.33 26.62,31.2 v25.31,31.2
KEY2  (via drill 0.4)
  Top 0.305: SW2.2 13.34,11.03 11,13.37 11,20.27 4.1,20.27 1.78,22.59 v1.78,50.36 | v8.47,69.34 13.54,74.41 v13.54,75.47
  Top 0.8: SW2.1 | SW2.2 SW2.1 | SW2.1
  Bottom 0.305: v1.78,50.36 1.78,62.65 v8.47,69.34 | IC1.35 | IC1.35 | v13.54,75.47 13.54,86.25 14.05,86.76 14.05,87.79 IC1.35
KEY3  (via drill 0.4)
  Top 0.305: SW3.2 20.93,21.14 4.64,21.14 2.81,22.97 v2.81,50.35 | v9.56,69.34 14.59,74.37 v14.59,75.47
  Top 0.8: 27.26,23.1 SW3.1 | SW3.2 27.26,23.1 | 27.26,23.1 27.26,23.11
  Bottom 0.305: v2.81,50.35 2.81,62.56 v9.56,69.34 | IC1.36 | IC1.36 | IC1.36 | v14.59,75.47 14.59,86.39 14.86,86.66 14.86,87.88 IC1.36
KEY4  (via drill 0.4)
  Top 0.305: 20.91,39.39 5.94,39.39 v5.94,50.36 | v13.06,69.24 17.9,74.08 v17.9,75.42
  Top 0.8: 20.91,39.39 SW4.1 | 20.91,39.39 SW4.2 | 20.91,39.39 20.91,39.38
  Bottom 0.305: v5.94,50.36 5.94,62.13 v13.06,69.24 | IC1.39 | v17.9,75.42 17.9,86.12 17.25,86.77 IC1.39 | IC1.39
KEY5  (via drill 0.4)
  Top 0.305: 8.25,23.1 3.85,23.1 v3.85,50.35 | v10.74,69.24 15.66,74.16 v15.66,75.46
  Top 0.406: SW5.1 | SW5.2 8.25,23.1 8.25,23.11
  Top 0.8: SW5.2 8.21,23.1 8.21,23.11 | SW5.2 8.17,23.1 8.17,23.11 | SW5.2 SW5.1
  Bottom 0.305: v3.85,50.35 3.85,62.35 v10.74,69.24 | IC1.37 15.65,87.94 15.66,87.95 v15.66,75.46
LCD_CS  (via drill 0.4)
  Top 0.254: LCD1.5 18.48,47.87 v21.84,47.87
  Bottom 0.254: IC1.6 20.45,50.08 21.84,48.69 v21.84,47.87
LCD_LED+
  Top 0.254: 3.81,52.07 3.77,52.02 DZ1.3 | LCD1.10 10.6,45.88 10.6,47.9 6.52,51.98 3.81,51.98
  Top 0.406: 3.05,58.04 3.05,57.91 1.78,57.91 1.78,52.07 3.81,52.07 3.81,51.98 DZ1.3 | 3.05,58.04 C12.1 | DSK1.1 3.05,59.89 3.05,58.04
LCD_LED-
  Top 0.254: IC5.3 7.17,55.31 7.11,55.37 7.11,52.28 11.29,48.1 11.29,46.38 LCD1.9 | LCD1.9 | LCD1.9 13.4,46.38
  Top 0.406: DZ1.1 4.75,54.18 4.75,55.28 7.14,55.28 7.14,55.31 IC5.3
LCD_PWM  (via drill 0.4)
  Top 0.305: R14.2 15.41,51.63 21.26,57.48 v21.26,61.96
  Bottom 0.305: IC1.5 21.25,72.32 21.26,72.32 v21.26,61.96
LCD_RESET  (via drill 0.4)
  Top 0.254: v20.92,46.03 20.32,46.03 19.98,46.37 18.54,46.37 LCD1.2
  Bottom 0.254: IC1.7 19.65,49.74 20.92,48.47 v20.92,46.03
LCD_SHDN  (via drill 0.4)
  Top 0.305: 12.95,56.45 14.48,56.45 22.05,64.02 v22.05,65.15
  Top 0.406: R11.1 12.95,56.45 12.95,56.28 10.14,56.28 10.14,56.26 IC5.5
  Bottom 0.305: IC1.4 22.05,72.34 v22.05,65.15
LEFT  (via drill 0.4)
  Top 0.18: v38.31,87.01 38.31,84.96 40.64,82.63 v40.64,73.49 | v37.59,29.87 37.59,45.87 37.6,45.88 37.6,52.76 40.62,55.78 40.62,62.81 40.07,63.36 v40.07,65.51
  Bottom 0.18: v38.31,87.01 38.31,88.68 R3.1 | v40.64,73.49 IC2.46 40.64,69.13 40.06,68.55 40.06,65.49 v40.07,65.5 v40.07,65.51 | v37.59,29.87 37.59,19.86 24.91,7.18 DOCK1.9
  Bottom 0.406: 35.54,88.68 R3.1 35.58,92.08 AU1.3
LOCK_KEY  (via drill 0.4)
  Top 0.406: v5.08,87.33 v5.08,71.8
  Bottom 0.406: v5.08,87.33 SL1.2 | v5.08,71.8 9.65,71.8 10.66,72.81 IC1.17
MISO  (via drill 0.4)
  Top 0.305: v25.5,67.29 16.92,67.29 v14.85,69.32
  Bottom 0.18: v25.5,67.29 IC2.30
  Bottom 0.305: v25.5,67.29 25.5,58.81 41.25,43.06 SD1.7 | IC1.13 14.85,72.32 v14.85,69.32
MOSI  (via drill 0.4)
  Top 0.254: LCD1.3 20.34,46.87 20.48,47.01 22.09,47.01 26.38,51.3
  Top 0.305: v15.65,70.04 15.65,69.67 17.22,68.1 25.92,68.1 26.38,67.64 v26.38,66.57 26.38,51.3 v28.45,49.23
  Bottom 0.18: IC2.29 27.69,66.79 27.47,66.57 v26.38,66.57
  Bottom 0.305: 42.87,38.66 SD1.3 | IC1.12 v15.65,70.04 | IC1.12 | v28.45,49.23 32.25,45.43 33.3,45.43 40.07,38.66 SD1.3 | SD1.3 | SD1.3 | SD1.3 | SD1.3
N$1
  Bottom 0.18: IC2.17 39.64,58.43 39.79,58.28 Q1.1
  Bottom 0.406: 40.9,56.15 R22.1 | 40.9,56.15 Q1.1 | C1.1 40.9,53.61 | 40.9,53.61 40.9,56.15 | 40.9,53.61 40.89,53.6
N$2
  Bottom 0.18: IC2.18 39.14,61.42 38.4,60.68 Q1.3
  Bottom 0.406: 38.19,56.15 R22.2 37.15,56.15 | Q1.3 35.16,60.68 35.16,56.15 37.15,56.15 | 37.15,56.15 C2.1
N$3
  Bottom 0.406: R2.2 43.9,78.88 44.73,78.05 C4.1
N$4
  Bottom 0.406: C5.1 R3.2
N$5
  Bottom 0.406: C6.1 41.29,77.83 42.02,78.56 R4.2
N$6
  Bottom 0.305: Q2.3 | Q2.3
  Bottom 0.406: IC1.23 5.59,78.9 4.79,78.1 Q2.3 | Q2.3 | Q2.3 | Q2.3 C8.2 | Q2.3
N$7
  Bottom 0.305: Q2.1 | Q2.1 | Q2.1
  Bottom 0.406: IC1.24 8,79.7 7.59,80.11 Q2.1 | Q2.1 | C7.2 Q2.1 | Q2.1
N$8
  Bottom 0.406: C9.2 27.85,71.84 27.85,75.7 IC1.62
N$9
  Bottom 0.18: 43.51,66.29 IC2.9 IC2.10 IC2.11 | 36.07,64.79 36.07,68.79 IC2.33 IC2.34 33.74,69.29 33.74,70.29 IC2.36 | IC2.25 36.07,64.79 | 36.07,64.79 IC2.12 IC2.11 | IC2.11 R1.1
N$10
  Bottom 0.305: IC1.18 9.78,74.9 8.99,74.11 7.7,74.11 Q3.2 | Q3.2
N$11
  Bottom 0.305: IC1.19 9.75,75.7 8.73,74.68 6.78,74.68 6.78,74.21 4.4,74.21 Q3.1 | Q3.1 | Q3.1
N$12
  Bottom 0.18: C3.1 38.32,74.14 39.64,72.82 IC2.44
N$13
  Top 0.305: 8,27.79 8.09,27.7 SW5.4 8.18,27.7 8,27.88 R5.1
  Top 0.406: SW5.4 8.23,27.73 8,27.96
  Top 0.8: SW5.4 SW5.3 SW3.4 SW3.3 | 30.3,27.7 SW3.3 | SW1.4 30.3,27.7 | SW1.3 | SW1.3 SW1.4 | SW1.3 | 33.49,27.67 33.49,27.7 SW1.4 | SW4.4 SW4.3 | SW4.4 27.38,34.79 27.38,34.8 | SW3.3 27.34,27.7 27.34,34.79 SW4.4 | SW2.3 SW2.4 | SW2.3 | SW2.3 27.23,18.29 30.3,21.36 30.3,27.7
N$14
  Top 0.305: T1.3 27.83,94.62 30.18,92.27 30.18,91.06 LED1.K
N$15
  Top 0.305: 24.93,92.35 24.94,92.35 T1.2 | R7.1 24.93,92.35 | 24.93,92.35
N$18
  Top 0.406: R10.1 | R10.1 LED2.A | R10.1
N$19
  Top 0.406: 7.14,57.21 7.14,57.18 | 7.14,57.21 IC5.1 7.37,57.21 | 5.33,57.29 5.33,57.4 | 5.33,57.29 DSK1.2 | 7.14,57.21 5.33,57.21 5.33,57.29 | L1.P$1 3.81,62.46 3.81,60.96 7.37,60.96 7.37,57.21 | 7.37,57.21 7.37,57.15
N$20
  Top 0.305: C16.1 33.57,60.97 33.56,60.98 IC8.4
N$21
  Top 0.406: IC5.4 10.04,55.31 10.04,54.68 12.24,54.68 12.24,54.81 R13.1 13.95,54.81 R12.2 | R12.2 13.95,54.88 | R12.2
N$23  (via drill 0.4)
  Top 0.254: IC6.5 40.51,9.71 v41.4,10.6
  Bottom 0.254: 44.83,10.6 44.78,10.6 v41.4,10.6
  Bottom 0.305: SW7.2 44.78,10.6 44.78,10.51
  Bottom 0.8: SW7.2 | SW7.2 SW7.1 | SW7.2
N$24
  Top 0.406: 10.45,53.11 10.45,53.18 | 10.45,53.11 C14.1 | 10.45,53.11 10.45,51.63 R14.1 12.24,51.63 12.24,53.11 R13.2
RESET  (via drill 0.4)
  Top 0.254: v18.78,70.28 21.73,73.23 v21.73,74.63 | v22.06,8.74 23.89,6.91 v30.99,6.91
  Bottom 0.254: 21.2,8.74 21.2,44 20.15,45.05 20.15,48.02 18.78,49.39 v18.78,70.28 | 21.2,8.74 R15.1 21.2,6.82 21.91,6.11 DOCK1.15 21.91,5.08 | IC1.20 | v30.99,6.91 SW6.3 | 21.2,8.74 v22.06,8.74
  Bottom 0.305: v21.73,74.63 12.68,74.63 12.26,75.05 12.26,76.5 IC1.20
  Bottom 0.8: 34.96,6.89 SW6.3 SW6.4
RIGHT  (via drill 0.4)
  Top 0.18: v37.14,78.49 38.39,79.74 v38.96,79.74 | 34.62,45.83 34.62,45.86 | 34.62,45.83 v34.62,29.87 | v37.96,65.51 37.96,64.05 39.35,62.66 39.35,57.62 34.61,52.88 34.61,45.83 34.62,45.83
  Bottom 0.18: v38.96,79.74 R4.1 | v37.14,78.49 IC2.39 37.14,71.15 37.55,70.3 37.55,65.46 37.96,65.49 v37.96,65.51 | v34.62,29.87 34.62,18.38 23.91,7.67 DOCK1.11 23.91,5.09
  Bottom 0.406: AU1.2 45.1,82.91 43.93,81.74 40.28,81.74 40.28,79.74 R4.1
RXD
  Bottom 0.254: IC1.2 23.65,8.24 22.91,7.5 DOCK1.13
SCK  (via drill 0.4)
  Top 0.254: 17.82,48.69 22.74,48.69 25.51,51.46 v25.51,53.06 | LCD1.4 17.14,47.37 17.14,48.69 17.82,48.69 | 17.82,48.69 17.81,48.69 | v39.53,40.87 v39.53,36.16
  Top 0.305: v16.46,70.8 v16.46,70.79 16.46,70.06 17.67,68.85 26.13,68.85 27.35,67.63 v27.35,65.66 v27.35,53.06
  Bottom 0.18: IC2.28 28.5,66.29 27.87,65.66 v27.35,65.66
  Bottom 0.254: v27.35,53.06 27.36,53.04 | 42.62,40.86 42.64,40.84 | 42.62,40.86 SD1.5 | 42.61,40.87 42.62,40.86 | v39.53,36.16 39.53,20.63 25.91,7.01 DOCK1.7
  Bottom 0.305: IC1.11 | IC1.11 | IC1.11 v16.46,70.79 | IC1.11 | v27.35,53.06 v25.51,53.06 | 42.61,40.87 v39.53,40.87 27.36,53.04
SD_CS
  Bottom 0.254: IC1.1 24.45,46.64 30.57,40.52 33.54,40.52 36.5,37.56 42.48,37.56 SD1.2
SELI  (via drill 0.4)
  Top 0.305: v9.27,80.5 9.27,72.04 7.34,70.11 7.34,68.25 v10.59,65
  Bottom 0.305: R19.2 13.23,14.94 13.59,15.3 IC4.2 | IC4.2 | IC4.2 13.59,18.29 13.12,18.76 13.12,62.47 v10.59,65 | IC1.25 | IC1.25 | IC1.25 v9.27,80.5
SELV  (via drill 0.4)
  Top 0.305: v9.27,81.67 8.44,81.67 8.44,72.24 6.52,70.32 6.52,67.51 v9.79,64.24
  Bottom 0.305: 12.34,17.07 R20.2 12.28,17.07 IC4.1 12.32,61.71 v9.79,64.24 | IC1.26 10.67,81.3 | IC1.26 | v9.27,81.67 9.27,81.3 IC1.26
TV_DATA  (via drill 0.4)
  Top 0.305: v19.23,73.83 19.23,81.97 23.04,85.78 T1.1 | T1.1 | T1.1
  Bottom 0.305: IC1.15 13.25,73.83 v19.23,73.83
TXD
  Bottom 0.254: IC1.3 22.85,8.28 22.4,7.83 22.4,5.15 22.39,5.14 DOCK1.14
VCC  (via drill 0.4)
  Top 0.254: v16.12,45.87 LCD1.1 | v16.12,45.87 | LCD1.6 14.76,47.88 14.76,46.36 15.25,45.87 16.14,45.87 v16.12,45.87 | IC6.2 IC6.1 42.48,12.91 | 42.48,12.91 42.48,12.95 | C33.+ 42.48,15.56 42.48,12.91
  Top 0.305: SL1.3 9.54,94.24 10.01,93.77 R6.2 11.68,94.82 18.31,94.82 IC3.8 19.7,93.78 20.57,92.91 v20.57,85.44 18.51,83.38 18.51,80.39 15.43,77.3 13.95,77.3 | IC8.3 31.57,59.55 29.67,59.55 29.67,58.28 | IC8.1 29.67,58.28 | 29.67,58.28 29.66,58.28 | v33.13,62.46 v33.13,64.86
  Top 0.406: C10.+ 13.95,77.3 v12.04,77.3 | v16.12,45.86 v16.12,45.87 | IC5.6 9.87,57.21 9.87,58.33 v9.58,58.62 | v17.57,70.76 20.57,73.76 v20.57,81.96 22.96,81.96 | C13.+ 14.72,60.39 14.72,62.46 | 22.96,81.96 22.98,81.96 | v29.04,54.01 v30.53,55.5 29.67,56.36 IC8.1 | v25.46,54.86 21.85,54.86 16.12,49.13 16.12,45.89 | v16.12,45.86 v16.12,45.87 16.12,45.89 | 16.12,45.89 v16.12,45.86 | 22.96,81.96 25.21,81.96 32.72,89.47 | LED1.A 32.72,89.47 | L1.P$2 8.13,62.46 v8.09,62.46 14.72,62.46 | v16.13,62.46 v16.14,62.46 14.72,62.46 | R18.2 44.46,86.38 41.37,89.47 32.72,89.47 | 32.72,89.47 32.71,89.47 | v40.73,39.76 v40.72,39.76 v40.72,42.33 40.72,51 43.44,53.72 43.44,58.79 43.45,58.8 R17.2 | C15.+ 40.73,39.76 v40.73,39.76 | 20.88,41.13 30.52,41.13 v30.52,31.9 | 20.88,41.13 20.85,41.13 | 40.73,31.9 v38.49,31.9 | 40.73,31.9 42.67,29.96 42.67,15.81 42.46,15.6 C33.+ | 16.12,41.13 v10.55,41.13 | 16.12,45.89 16.12,41.13 | 16.12,41.13 20.88,41.13 | v40.73,39.76 40.73,31.9 | v10.62,7.91 v14.89,7.91
  Bottom 0.18: IC2.32 35.53,68.29 35.53,65.29 IC2.26 33.56,65.29 v33.13,64.86
  Bottom 0.254: R15.2 19.5,7.19 20.41,6.28 | 20.41,6.28 DOCK1.18 | v14.89,7.91 17.39,7.91 19.02,6.28 20.41,6.28 | R16.1 v10.62,7.91 | R16.1
  Bottom 0.305: IC1.52 | R16.1 9.54,9.22 8.77,9.99 R19.1 R20.1 8.77,16.56 | v20.57,85.44 23.03,85.44 24.78,83.69 IC1.52 | IC1.52 | IC1.52 | SD1.4 | v33.13,62.46 33.13,56.91 31.72,55.5 v30.53,55.5
  Bottom 0.406: R16.1 | IC1.21 | IC1.21 | IC1.21 v12.04,77.3 | v10.55,41.13 10.55,35.88 5.59,30.92 5.59,12.09 9.77,7.91 v10.62,7.91 | v8.09,62.46 8.09,60.11 v9.58,58.62 | v16.13,62.46 16.12,68.28 17.57,69.73 v17.57,70.76 | v20.57,85.44 v20.57,81.96 22,80.53 22,76.86 24.76,74.1 IC1.64 | v25.46,54.86 26.31,54.01 v29.04,54.01 v40.72,42.33 | SD1.4 v40.72,39.76 | v16.12,45.87 16.12,49.06 17.8,50.74 17.8,60.79 v16.13,62.46 | v16.13,62.46 | v38.49,31.9 v30.52,31.9
VCC_BAT  (via drill 0.4)
  Top 0.254: 42.47,6.55 42.48,6.54 | C32.1 42.47,6.55 | IC6.8 42.46,6.56 42.47,6.55
  Top 0.406: R8.1 | v33.38,29.83 33.38,45.87 28.25,51 28.26,69.7 30.08,71.52 R8.1 | 42.53,3.29 JP1.1 39.66,3.29 33.38,9.57 | v33.38,18.88 33.38,9.57 | v19.74,9.56 33.38,9.56 33.38,9.57 | R8.1 30.08,74.82
  Top 0.8: JP1.1 C32.1
  Bottom 0.406: IC4.5 16.13,9.56 v19.74,9.56 | v33.38,29.83 v33.38,18.88
VCC_CHRG  (via drill 0.4)
  Top 0.406: v12.92,13.95 17.82,13.95 v17.82,17.07 | C18.+ 8.98,5.87 | 8.98,5.87 IC7.3 | 10.41,5.87 8.98,5.87 | 10.41,5.87 | 13.6,5.87 10.41,5.87 | v13.58,5.87 13.6,5.87 | 13.6,5.87 14.23,5.87 14.73,5.37 | R10.2 14.73,4.21 14.73,5.37 | v22.1,1.87 18.6,5.37 14.73,5.37
  Bottom 0.254: DOCK1.12 23.41,1.87 v22.1,1.87
  Bottom 0.406: v12.92,13.95 13.59,13.28 IC4.7 13.58,10.91 v13.58,5.87 | IC4.4 v17.82,17.07 v17.81,17.07 | v17.81,17.07 v17.81,17.06 | C11.+ 17.81,19.78 v17.81,17.07
XCS  (via drill 0.4)
  Top 0.18: v36.64,61.97 34.53,61.97 34.01,62.49 34.01,65.77 32.65,65.77 31.06,67.36 v31.06,70.67
  Bottom 0.18: IC1.47 23.65,89.17 26.83,89.17 29.14,86.86 29.17,72.96 29.17,72.56 v31.06,70.67 | IC2.23 v36.64,61.97
XDCS  (via drill 0.4)
  Top 0.18: v43,63.73 40.55,66.18 40.55,66.19 32.89,66.19 32.31,66.77 v32.31,70.51
  Bottom 0.18: IC1.46 22.85,89.72 27.25,89.72 29.93,87.03 29.93,72.98 31.89,71.02 v32.31,70.51 | IC2.13 42.56,63.29 v43,63.73
XRESET  (via drill 0.4)
  Top 0.18: v34.47,71.43 44.25,71.43 45.21,70.47 v45.21,69.58 v45.2,69.57 v45.2,69.58 44.38,69.58 44.15,69.81 R21.2
  Bottom 0.18: IC1.45 22.05,90.33 27.51,90.33 30.7,87.12 30.7,73.35 32.64,71.43 v34.47,71.43 | v45.2,69.58 44.41,69.58 44.13,69.3 43.16,69.3 IC2.3

### Text on the board
tNames: + | _
bNames: teslabs.com/openplayer | openplayer rev1.1 | gerard marull | RESET | E. RESET